# EasyEDA schematic 3.json
TITLE: Sheet_1; REV: 1.0; Date: 2020-12-14; Sheet: 1/1; Drawn By: ersinalcinn; Company: Your Company
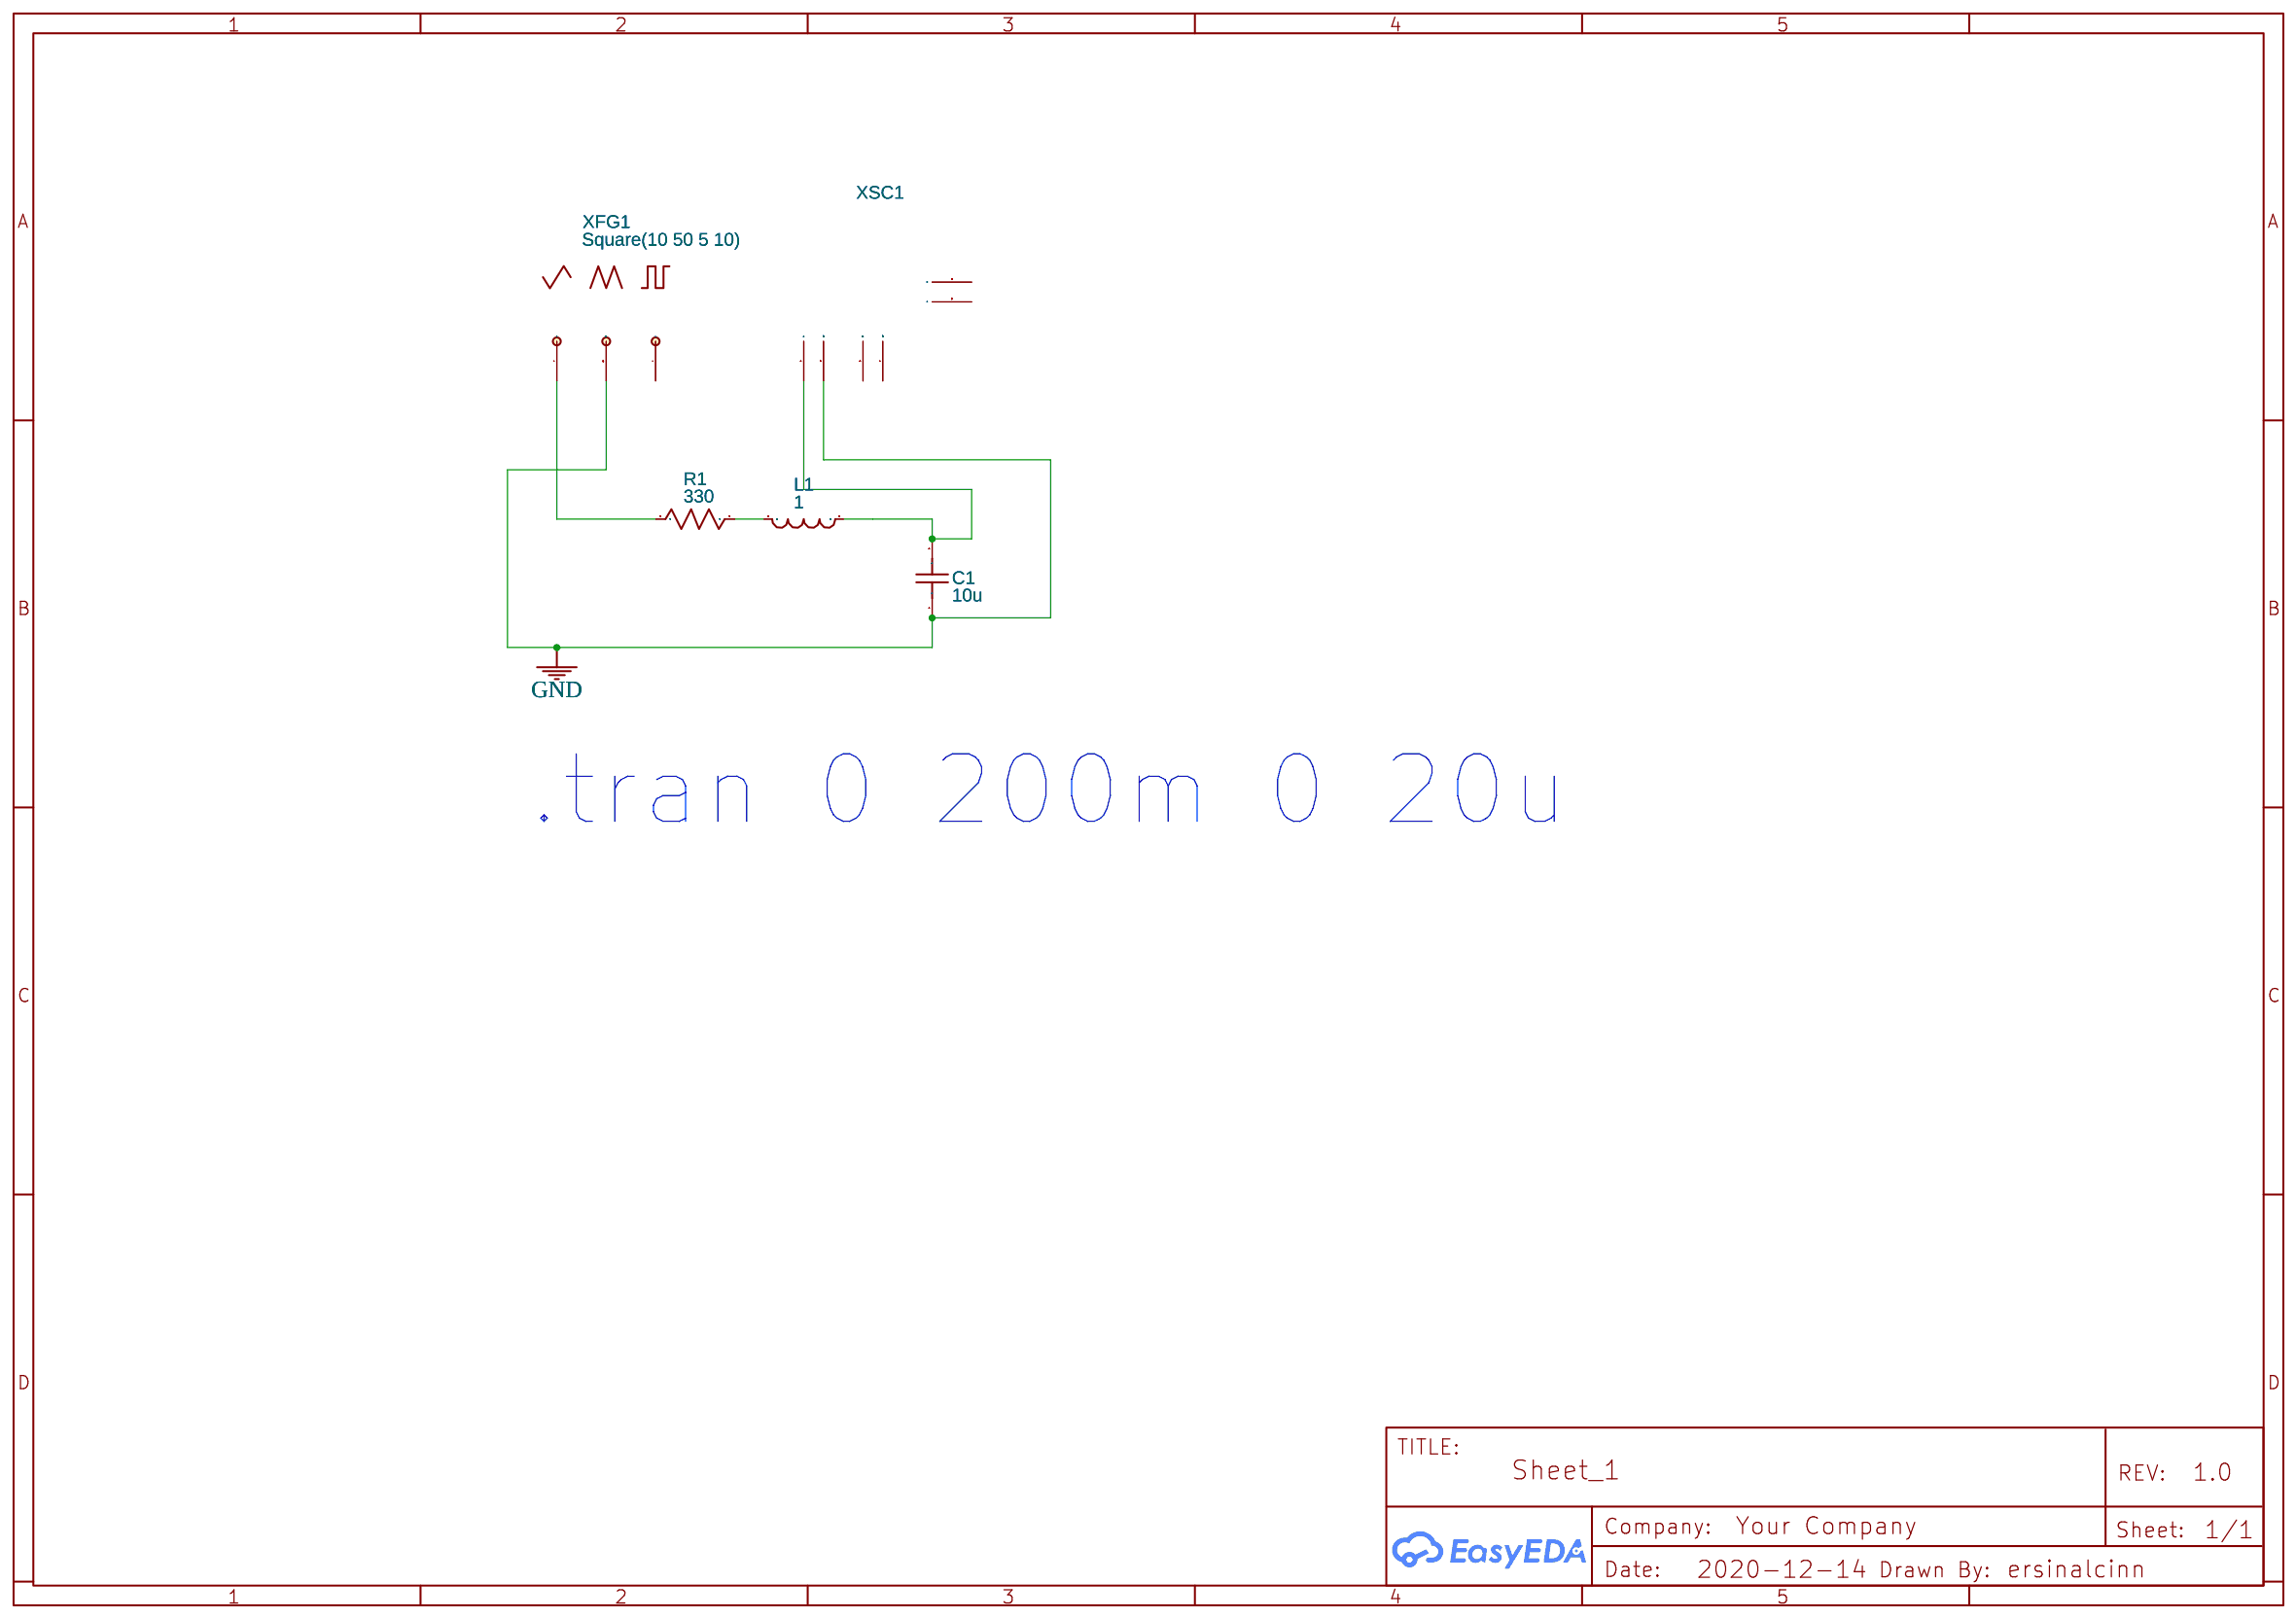
[diagram p0: schematic sheet]

## Parts
C1  10u  [RAD-0.1]
L1  1  [AXIAL-0.4]
R1  330  [AXIAL-0.3]
XFG1  Square(10 50 5 10)
XSC1  Oscilloscope

## Library data of the parts
C1 = Capacitor_US: Contributor: EasyEDA; Supplier: YUJING; Capacitance: 1u
L1 = Inductor: Supplier: YUJING; Contributor: EasyEDA; Inductance: 1m
R1 = Resistor_US: Resistance: 1k; Contributor: EasyEDA; Supplier: YUJING
XFG1 = FUNCTIONGENERATOR: Supplier: LCSC; Waveforms: Rectangular Wave; Frequency: 10; Duty cycle: 50; Amplitude: 5; Offset: 0; Rise/Fall Time: 10; NameDisplay: 1; Contributor: EasyEDA; sim: true
XSC1 = OSCILLOSCOPE: Contributor: EasyEDA; NameDisplay: 0; sim: true

## Nets
GND: C1.1 XFG1.COM XSC1.2(GND1)
Net-(C1-2): C1.2 L1.1 XSC1.1(A)
Net-(L1-2): L1.2 R1.2
Net-(R1-1): R1.1 XFG1.+

Not connected (* = marked no-connect by the designer): XFG1 -; XSC1 3(B) 4(GND2) 5(T+) 6(T-)

## Notes on the sheet
- .tran 0 200m 0 20u
